# Altium schematic sheet Tone Stack.SchDoc
size A4
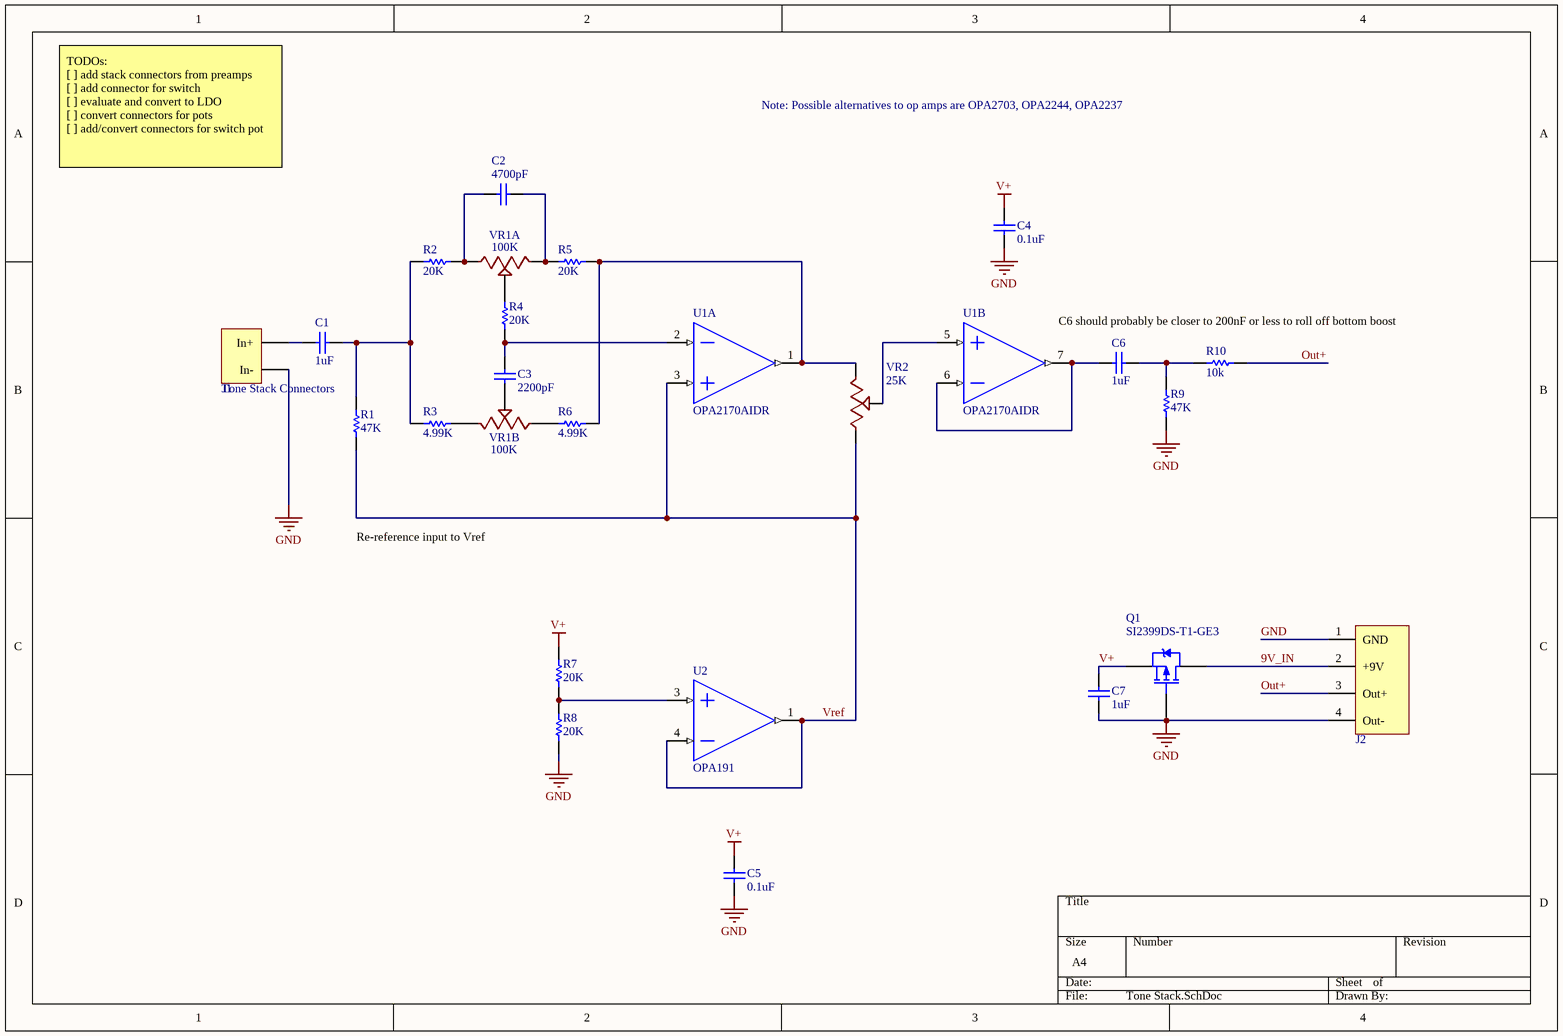
[diagram p0: Tone Stack.SchDoc]

## Parts
C1  1uF  [CAPC1608X09N]
C2  4700pF  [CAPC1608X09N]
C3  2200pF  [CAPC1608X09N]
C4  0.1uF  [CAPC1608X09N]
C5  0.1uF  [CAPC1608X09N]
C6  1uF  [CAPC1608X09N]
C7  1uF  [CAPC1608X09N]
J1  Tone Stack Connectors  [Conn 2 Pin 2.54mm Pitch]
J2  Tone Stack Output Conn  [Conn 4 Pin 2.54mm Pitch]  (value not drawn)
Q1  SI2399DS-T1-GE3  [SOT95P237X112-3N]
R1  47K  [RESC1608X06N]
R2  20K  [RESC1608X06N]
R3  4.99K  [RESC1608X06N]
R4  20K  [RESC1608X06N]
R5  20K  [RESC1608X06N]
R6  4.99K  [RESC1608X06N]
R7  20K  [RESC1608X06N]
R8  20K  [RESC1608X06N]
R9  47K  [RESC1608X06N]
R10  10k  [RESC1608X06N]
U1  OPA2170AIDR  [SOIC127P600X175-8M]  (parts A,B of 2)
U2  OPA191  [SOT23-5]
VR1  100K  [SM06B]  (parts A,B of 2)
VR2  25K  [SM04B]

## Nets
GND: C4.1 C5.1 C7.1 J1.2(In-) J2.1(GND) J2.4(Out-) Q1.1(G) R8.1 R9.1 U1.4(V-) U2.2(V-)
V+: C4.2 C5.2 C7.2 Q1.2(S) R7.2 U1.8(V+) U2.5(V+)
9V_IN: J2.2(+9V) Q1.3(D)
Out+: J2.3(Out+) R10.2
Vref: R1.1 U1.3(+IN_A) U2.1(Out) U2.4(-IN) VR2.2(B)
NetC1_1: C1.1 J1.1(In+)
NetC1_2: C1.2 R1.2 R2.1 R3.1
NetC2_1: C2.1 R2.2 VR1.4(B1)
NetC2_2: C2.2 R5.1 VR1.5(A1)
NetC3_1: C3.1 VR1.3(W2)
NetC3_2: C3.2 R4.1 U1.2(-IN_A)
NetC6_1: C6.1 U1.6(-IN_B) U1.7(OUT_B)
NetC6_2: C6.2 R9.2 R10.1
NetR3_2: R3.2 VR1.6(A2)
NetR4_2: R4.2 VR1.2(W1)
NetR5_2: R5.2 R6.2 U1.1(Out_A) VR2.3(A)
NetR6_1: R6.1 VR1.1(B2)
NetR7_1: R7.1 R8.2 U2.3(+IN)
NetU1_5: U1.5(+IN_B) VR2.1(W)

## Notes on the sheet
- Note: Possible alternatives to op amps are OPA2703, OPA2244, OPA2237
- TODOs:
  [ ] add stack connectors from preamps
  [ ] add connector for switch
  [ ] evaluate and convert to LDO
  [ ] convert connectors for pots
  [ ] add/convert connectors for switch pot
- (near U1) C6 should probably be closer to 200nF or less to roll off bottom boost
- Re-reference input to Vref

## Library data of the parts
C1 C6 C7 = CAP CER 1uF 0603: Manufacturer: Murata; Manufacturer Part Number: GRM188R7YA105KA12D; Voltage: 35V; Rating: X7R; Tolerance: 10%; Value: 1uF; Digikey Part Number: 490-10487-1-ND
C2 = CAP CER 4700pF 0603: Manufacturer: TDK; Voltage: 100V; Tolerance: 5%; Rating: C0G; Value: 4700pF; Digikey Part Number: 445-172684-1-ND
C3 = CAP CER 2200pF 0603: Manufacturer: Murata; Voltage: 50V; Tolerance: 1%; Rating: C0G; Value: 2200pF; Digikey Part Number: 490-7768-1-ND
C4 C5 = CAP CER 0.1uF 0603: Voltage: 50V; Rating: X7R; Tolerance: 10%; Value: 0.1uF; Digikey Part Number: 490-1519-1-ND; Package: 0603
Q1 = MOSFET_P_CH_20V_6A_SOT23-3: Reverse Voltage MOSFET; Manufacturer: Vishay Siliconix; VDS: 20V; Rds On (Max): 34 mOhm @ 5.1A, 10V; Digikey Part Number: SI2399DS-T1-GE3CT-ND; Value: SI2399DS-T1-GE3
R1 R9 = RES 47K 0603: Tolerance: 1%; Type: RES; Footprint: 0603; Value: 47K; Digikey Part Number: 311-47.0KHRCT-ND
R2 R4 R5 R7 R8 = RES 20K 0603: Tolerance: 1%; Power: 0.1W; Footprint: 0603; Value: 20K; Digikey Part Number: 311-20.0KHRCT-ND
R3 R6 = RES 4.99K 0603: Tolerance: 1%; Type: RES; Footprint: 0603; Value: 4.99K; Digikey Part Number: 311-4.99KHRCT-ND
R10 = RES 10K 0603: Manufacturer: Yageo; Manufacturer Part Number: RC0603FR-0710KL; Tolerance: 1%; Power: 0.1W; Type: RES; Footprint: 0603; Temperature: 155dC; Digikey Part Number: 311-10.0KHRCT-ND; Value: 10k
U1 = OPA2170AIDR: Low Power CMOS Amp; Manufacturer: Texas Instruments; Amplifier: Low Power
U2 = OPA191: Low Power CMOS Amp; Manufacturer: Texas Instruments; Amplifier: Low Power
VR1 = Pot - Dual Gang: Cable: 455-3015-ND; Digikey Part Number: 455-1806-1-ND; Value: 100K
VR2 = Pot - Single Gang: Cable: 455-3002-ND; Value: 25K; Digikey Part Number: 455-1804-1-ND